# Altium project Amplifier.PrjPcb
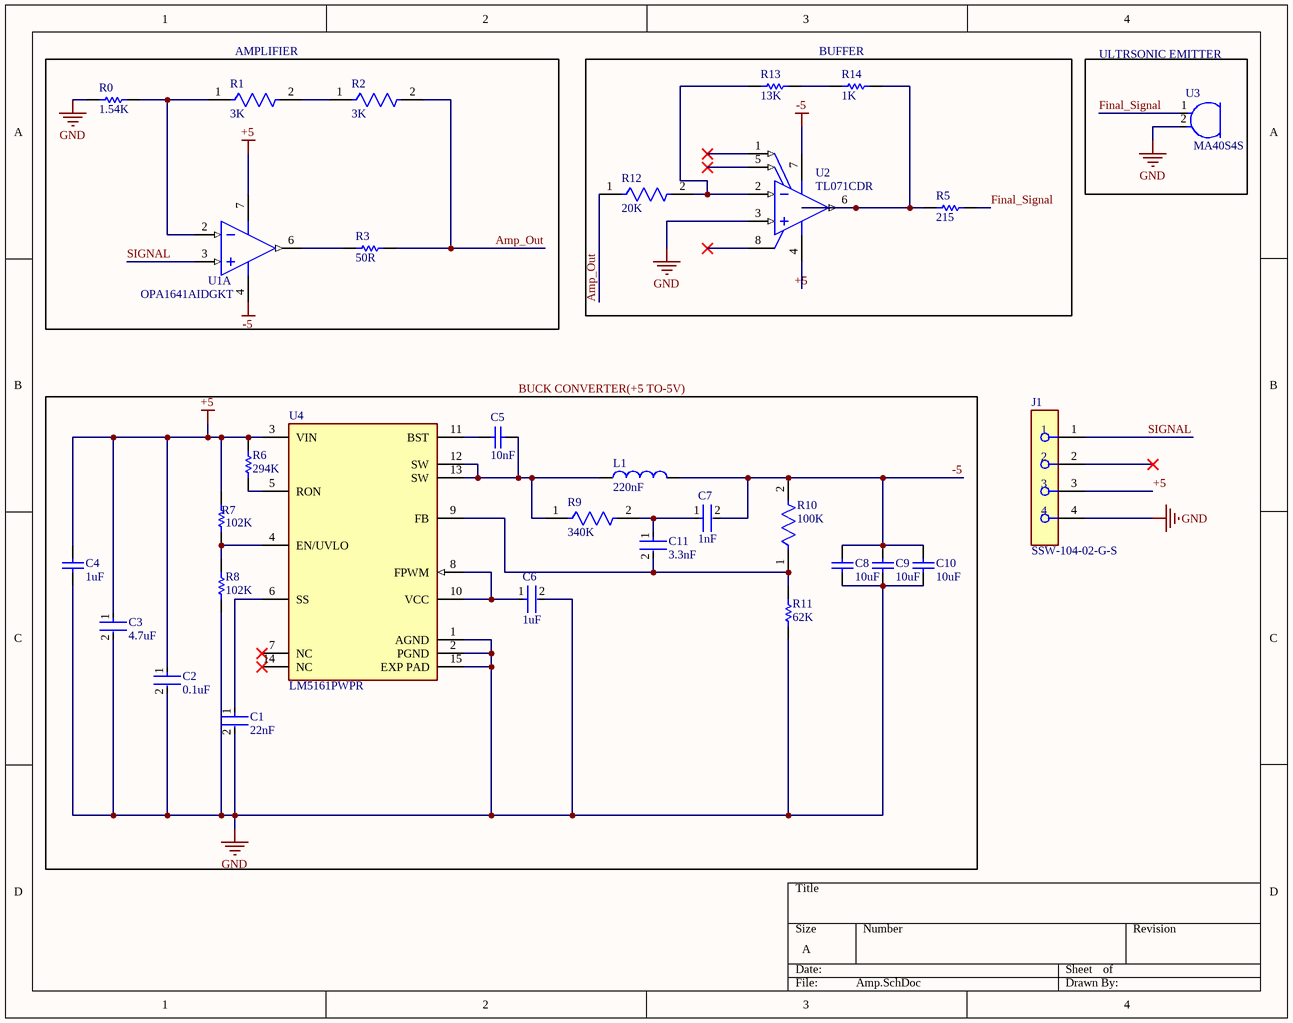
[diagram p0: Amp.SchDoc]
1 sheet, 31 parts. Net scope: global (net labels, ports and power ports of the same name join across sheets).
Board file: AmpPCB.PcbDoc

## Sheet Amp.SchDoc
size A; SheetNumber: 1; SheetTotal: 1

### Parts
C1  22nF  [FP-CGA4J-MFG]
C2  0.1uF  [FP-CC0805-0_85-MFG]
C3  4.7uF  [FP-GRM31C-0_2-e0_3_0_8-IPC_C]
C4  1uF  [CAPC3216X180X50ML20T25]
C5  10nF  [CAPC1005X55X25LL05T10]
C6  1uF  [FP-CGA3E-0_3-0_1-MFG]
C7  1nF  [FP-CGA2B-MFG]
C8  10uF  [CAPC3216X180X55LL20T25]
C9  10uF  [CAPC3216X180X55LL20T25]
C10  10uF  [CAPC3216X180X55LL20T25]
C11  3.3nF  [FP-CL31-IPC_C]
J1  SSW-104-02-G-S  [FP-SSW-104-02-G-S-MFG]
L1  220nF  [WE-HCF_2920]
R0  1.54K  [RESC2013X70X40LL20T20]
R1  3K  [FP-RC2012-MFG]
R2  3K  [FP-RC2012-MFG]
R3  50R  [RESC2013X70X40LL20T20]
R5  215  [RESC2013X70X40NL20T20]
R6  294K  [RESC1005X40X25LL05T05]
R7  102K  [RESC2013X60X35LL10T20]
R8  102K  [RESC2013X60X35LL10T20]
R9  340K  [FP-CRCW0402-e3-MFG]
R10  100K  [FP-RC0603-0_55-MFG]
R11  62K  [RESC1608X55X25NL10T15]
R12  20K  [FP-RT0805-MFG]
R13  13K  [RESC2013X70X40NL20T20]
R14  1K  [RESC2013X70X40ML20T20]
U1  OPA1641AIDGKT  [DGK0008A_N]  (part A of 2)
U2  TL071CDR  [D0008A_M]
U3  MA40S4S  [FP-MA40S4S-MFG]
U4  LM5161PWPR  [FP-PWP0014A-MFG]

### Blocks framed on the sheet
AMPLIFIER: R0-R3 U1
BUFFER: R5 R12-R14 U2
ULTRSONIC EMITTER: U3

### Nets
+5: C2.1 C3.1 C4.2 J1.3 R6.2 R7.2 U1.7(V+) U2.4(VCC-) U4.3(VIN)
-5: C7.2 C8.1 C9.1 C10.1 L1.2 R10.2 U1.4(V-) U2.7(VCC+)
GND: C1.2 C2.2 C3.2 C4.1 C6.2 C8.2 C9.2 C10.2 J1.4 R0.1 R8.1 R11.1 U2.3(IN+) U3.2 U4.1(AGND) U4.2(PGND) U4.15(EXP_PAD)
Amp_Out: R2.2 R3.2 R12.1
Final_Signal: R5.2 U3.1
SIGNAL: J1.1 U1.3(IN+)
NetC1_1: C1.1 U4.6(SS)
NetC5_1: C5.1 U4.11(BST)
NetC5_2: C5.2 L1.1 R9.1 U4.12(SW) U4.13(SW)
NetC6_1: C6.1 U4.8(FPWM) U4.10(VCC)
NetC7_1: C7.1 C11.1 R9.2
NetC11_2: C11.2 R10.1 R11.2 U4.9(FB)
NetR0_2: R0.2 R1.1 U1.2(IN-)
NetR1_2: R1.2 R2.1
NetR3_1: R3.1 U1.6(OUT)
NetR5_1: R5.1 R14.2 U2.6(OUT)
NetR6_1: R6.1 U4.5(RON)
NetR7_1: R7.1 R8.2 U4.4(EN/UVLO)
NetR12_2: R12.2 R13.1 U2.2(IN-)
NetR13_2: R13.2 R14.1

Not connected (* = marked no-connect by the designer): J1 2*; U2 1(OFFSET_N1)* 5(OFFSET_N2)* 8(NC)*; U4 7(NC)* 14(NC)*

### Notes on the sheet
- Labels drawn without touching a wire or pin: BUCK CONVERTER(+5 TO-5V)

### Library data of the parts
C1 = CMP-08246-000753-1: Cap Ceramic 22nF 50V C0G 5% Pad SMD 0805 +125°C Automotive T/R; Capacitance: 22nF; Case/Package: 0805; Lead Free: Lead Free; Ratings: AEC-Q200; Case Code (Imperial): 0805; Height: 1.25mm; Length: 2mm; Weight: 0.000194oz; Tolerance: 5%; Dielectric: C0G; Voltage Rating: 50V; Max Operating Temperature: 125°C; Mount: Surface Mount; Case Code (Metric): 2012; REACH SVHC: No SVHC; Depth: 1.25mm; Width: 0.049inch; Package Quantity: 1; Voltage Rating (DC): 50V; Termination: SMD/SMT; Min Operating Temperature: -55°C; Thickness: 0.057inch; Packaging: Tape and Reel; Composition: Ceramic
C2 = CMP-1036-04410-2: CAP CER 0.1UF 25V X7R 0805; Manufacturer Part Number: CC0805KRX7R8BB104; Manufacturer: Yageo; Tolerance: 0.1; Material: Ceramic; Value: 100 nF; ComponentLink2URL: http://www.yageo.com/documents/recent/UPY-GPHC_Y5V_6.3V-to-50V_8.pdf; Category: Cap; Mouser Description: Multilayer Ceramic Capacitors MLCC - SMD/SMT 100nF 25V X7R 10%; Device Class L1: Passive Components; Footprint Url: http://www.yageo.com/exep/pages/download/literatures/UPY-C_GEN_24.pdf; Height: 0.95mm; Digikey Description: CAP CER 0.1UF 25V X7R 0805; Lead Free: Yes; Temperature Range High: +85°C; Temperature: -30°C to +85°C; Ipc Land Pattern Name: CAPC200125X85; Capacitance: 100 nF; Automotive: No; Octopart: https://octopart.com/cc0805krx7r8bb104-yageo-39467766; Device Class L2: Capacitors; Temperature Characteristic: X7R; Voltage Rating: 25 V; ComponentLink2Description: Datasheet; Temperature Range Low: -30°C; Device Class L3: Ceramic Capacitors; RoHS: TRUE; Package: CC0805-0.85
C3 = CMP-1037-04923-3: Chip Multilayer Ceramic Capacitors for General Purpose, 1206, 4.7uF, X7R, 15%, 10%, 50V; Height: 1.6mm; Voltage: 50V; Capacitance: 4.7uF; Lead Free: Lead Free; Max Operating Temperature: 125°C; Packaging: Tape and Reel; REACH SVHC: No SVHC; Voltage Rating: 50V; Mount: Surface Mount; Termination: SMD/SMT; Tolerance: 10%; Case/Package: 1206; Material: Ceramic; Depth: 1.6mm; Length: 3.2mm; Case Code (Metric): 3216; Voltage Rating (DC): 50V; Case Code (Imperial): 1206; Radiation Hardening: No; Width: 0.063inch; Thickness: 0.071inch; Package Quantity: 2000; Min Operating Temperature: -55°C; Dielectric: X7R
C4 = CMP-2000-04991-1: Chip Capacitor, 1 uF, +/- 10%, 25 V, -55 to 125 degC, 1206 (3216 Metric), RoHS, Tape and Reel; Manufacturer: Kemet; Temperature Coefficient / Code: +/-15%; Dielectric: X7R; Voltage Rating DC: 25V; Capacitance - nF: 1000nF; Class: Class1; Case Length: 3.2mm; Type: SMDMLCCX7R6.3-250VDCCommericalGrade; Case Width: 1.6mm; Product: GeneralTypeMLCCs; Capacitance: 1uF; Datasheet URL: https://ciiva.com/datasheet-click-18194173?src=ciiva&sig=6daff8c4; Operating Temperature Range: -55Cto+125C; Series: C1206C; RoHS: Details; Product Category: MultilayerCeramicCapacitorsMLCC-SMD/SMT; Manufacturer URL: http://www.kemet.com/; Minimum Operating Temperature: -55C; Dimensions: 1.6mmWx3.2mmLx1.6mmH; Termination Style: SMD/SMT; Brand: Kemet; Packaging: Reel; Package / Case: 1206(3216metric); Case Code - mm: 3216; Datasheet Version: Jul-14; Factory Pack Quantity: 2000; Package Description: 2-Pin Surface Mount Device, Body 3.2 x 1.6 mm; Tolerance: 10%; Package Reference: 1206; Case Height: 1.6mm; Case Code - in: 1206; Maximum Operating Temperature: +125C; Voltage Rating: 25V
C5 = CMP-2000-06332-1: Chip Capacitor, 10 nF, 16 V, 10%, -55 to 125 degC, 0402 (1005 Metric), RoHS, Tape and Reel; Manufacturer: Murata; Rated Voltage: 16V; Capacitance: 10000pF; Dielectric: X7R; Manufacturer URL: http://www.murata.com/; Package Description: 2-Pin Surface Mount Device, Body 1 x 0.5 mm; Case Size/Dimension: 0402; Tolerance (%): ±10%; Datasheet Version: 06/2016; Package Reference: 0402; Mounting Technology: SurfaceMount; Datasheet URL: http://psearch.en.murata.com/capacitor/product/GRM155R71C103KA01%23.pdf
C6 = CMP-08246-002551-1: Cap Ceramic 1uF 35V X7R 10% Pad SMD 0603 +125°C Automotive T/R; Termination: SMD/SMT; Packaging: Tape and Reel; Capacitance: 1uF; Tolerance: 10%; Mount: Surface Mount; Thickness: 0.035inch; Case Code (Imperial): 0603; Voltage Rating: 35V; Case/Package: 0603; Case Code (Metric): 1608; Dielectric: X7R; Width: 0.031inch; Length: 0.063inch; Min Operating Temperature: -55°C; Weight: 7.1E-05oz; Max Operating Temperature: 125°C; Voltage Rating (DC): 35V; Height: 0.8mm; Ratings: AEC-Q200; Package Quantity: 4000
C7 = CMP-08246-002303-1: Cap Ceramic 1nF 50V X7R 10% Pad SMD 0402 +125°C Automotive T/R; Width: 0.02inch; Thickness: 0.022inch; Min Operating Temperature: -55°C; Mount: Surface Mount; Voltage Rating (DC): 50V; Voltage Rating: 50V; Termination: SMD/SMT; Capacitance: 1nF; Case/Package: 0402; Depth: 0.5mm; Length: 1mm; Ratings: AEC-Q200; Height: 0.5mm; Dielectric: X7R; Radiation Hardening: No; Lead Free: Lead Free; Composition: Ceramic; Max Operating Temperature: 125°C; Case Code (Imperial): 0402; Tolerance: 10%; Case Code (Metric): 1005; REACH SVHC: No SVHC; Package Quantity: 1; Packaging: Tape and Reel; Weight: 2.3E-05oz
C8-C10 = CMP-2000-06352-1: Chip Capacitor, 10 uF, +/- 10%, 16 V, -55 to 125 degC, 1206 (3216 Metric), RoHS, Tape and Reel; Manufacturer: Murata; Other Names: 490-3911-6; Product Training Modules: High-CapMultilayerCeramicCapacitors; Capacitance: 10µF; Temperature Coefficient: X7R; Catalog Drawings: GRMSeries_1206_1.6; Featured Product: GA3SafetyRecognizedCapsandHi-CapMLCC; Online Catalog: GRMSeries; Voltage - Rated: 16V; Size / Dimension: 0.126"Lx0.063"W(3.20mmx1.60mm); Applications: GeneralPurpose; Package Description: 2-Pin Surface Mount Device, Body 3.2 x 1.6 mm; Datasheet Version: 03/2016; Package Reference: 1206; Manufacturer URL: http://www.murata.com/; Standard Package: 1; Mounting Type: SurfaceMount,MLCC; Thickness (Max): 0.071"(1.80mm); Category: Capacitors; Family: CeramicCapacitors; Lead Spacing: -; Tolerance: ±10%; Packaging: Digi-Reel®; Lead Style: -; Package / Case: 1206(3216Metric); Datasheet URL: http://search.murata.co.jp/Ceramy/image/img/A01X/G101/ENG/GRM31CR71C106KAC7-01.pdf; Operating Temperature: -55°C~125°C; Mounting Technology: SurfaceMount; Series: GRM; Ratings: -; Height - Seated (Max): -; Features: -
C11 = CMP-13271-001980-1: Cap Ceramic 3.3nF 50V X7R ±10% SMD 1206 +125°C Embossed T/R; Width: 0.063inch; Package Quantity: 1; Mount: Surface Mount; Dielectric: X7R; Min Operating Temperature: -55°C; Tolerance: 10%; Voltage: 50V; Material: Ceramic; Case/Package: 1206; Depth: 1.6mm; Thickness: 0.039inch; Max Operating Temperature: 125°C; Case Code (Imperial): 1206; Height: 0.85mm; Length: 3.2mm; Packaging: Tape and Reel; Case Code (Metric): 3216; Radiation Hardening: No; Voltage Rating: 50V; Capacitance: 3.3nF
J1 = CMP-00575-00296407-1: SSW-104-02-G-S Board to Board & Mezzanine Connectors Tiger Buy Socket Strip with PCB Tails, .100 Pitch; NexarPartId: 296407; Manufacturer Lifecycle Status: PRODUCTION; Gender: Receptacle; Pitch: 2.54mm; Number of Positions: 4; Contact Resistance: 10mΩ; Connector Type: Receptacle, Socket; Voltage Rating: 550V; Max Current Rating: 6.9A; Voltage Rating (DC): 655V; Voltage Rating (AC): 465V; Current Rating: 4.7A; RoHS: Compliant; Lead Pitch: 2.54mm; Min Operating Temperature: -55°C; Housing Material: Polymer; Length: 10.67mm; Mount: Through Hole; Orientation: Straight; Lifecycle Status: Production; Lead Free: Lead Free; REACH SVHC: No SVHC; Number of Rows: 1; Contact Plating: Gold; Radiation Hardening: No; Max Operating Temperature: 125°C; Housing Color: Black; Height: 8.64mm; Contact Material: Bronze, Gold, Nickel; Width: 2.41mm; Number of Contacts: 4; Packaging: Bulk; Termination: Solder; Depth: 2.41mm; Max Voltage Rating (AC): 550V; Color: Black
L1 = CMP-03913-88969860-2: 74437529203221 WE-HCF High Current Inductor, 220uH, 8.8A, 2.8MHz, 36.45mOhm; Saturation Current: 4.1A; Inductance: 220µH; DC Resistance (DCR): 36.45mΩ; Inductance Tolerance: 20%; RoHS: Compliant; Width: 28mm; Min Operating Temperature: -40°C; Height: 20.5mm; Ambient Temperature Range Low: -40°C; Ambient Temperature Range High: 75°C; Length: 25mm; Max Operating Temperature: 125°C; NexarPartId: 88969860
R0 = CMP-2001-04443-1: Manufacturer: Panasonic; Part Number: ERJ-6ENF1541V
R1 R2 = CMP-13261-005524-1: Res Thick Film 0805 3kΩ 1% 0.125W ±100ppm/°C Molded SMD T/R; Max Power Dissipation: 125mW; Resistance: 3kR; Voltage Rating (DC): 150V; Radiation Hardening: No; Case/Package: 0805; Width: 0.049inch; Case Code (Imperial): 0805; Case Code (Metric): 2012; Military Standard: Not; Depth: 1.25mm; Length: 0.079inch; Temperature Coefficient: 100ppm/°C; Composition: Thick Film; Contact Plating: Tin; Features: Moisture Resistant; Max Operating Temperature: 155°C; Packaging: Tape and Reel; Number of Terminations: 2; Height: 0.024inch; Lead Free: Lead Free; Tolerance: 1%; Min Operating Temperature: -55°C
R3 = CMP-2001-00425-1: Part Number: ERJ-6GEYJ510V; Manufacturer: Panasonic
R5 = CMP-2001-00039-1: Manufacturer: Panasonic; Part Number: ERJ-6ENF2150V
R6 = CMP-2002-08443-1: Part Number: CRCW0402294KFKED; Manufacturer: Vishay Dale
R7 R8 = CMP-2001-04571-1: Part Number: RC0805FR-07105KL; Manufacturer: Yageo
R9 = CMP-2002-08533-2: RES Thick Film, 340kΩ, 1%, 0.063W, 100ppm/°C, 0402; Max Power Dissipation: 63mW; Voltage Rating: 50V; Resistance: 340kR; Height: 0.35mm; Military Standard: Not; Length: 1mm; Tolerance: 1%; Depth: 0.5mm; Min Operating Temperature: -55°C; Termination: SMD/SMT; Max Operating Temperature: 155°C; Features: Automotive AEC-Q200; Case Code (Metric): 1005; Power Rating: 63mW; Number of Pins: 2; Weight: 2.3E-05oz; Package Quantity: 10; Lead Free: Lead Free; Number of Terminations: 2; Temperature Coefficient: 100ppm/°C; Case/Package: 0402; Voltage Rating (DC): 50V; Case Code (Imperial): 0402; Contact Plating: Tin; Width: 0.5mm; Packaging: Tape and Reel; Composition: Thick Film; Radiation Hardening: No
R10 = CMP-2100-03662-2: RES SMD 100K OHM 1% 1/10W 0603; Voltage Rating (DC): 50V; Resistance: 100kR; Max Power Dissipation: 100mW; Temperature Coefficient: 100ppm/°C; Working Voltage: 75V; Length: 1.6mm; Lead Free: Lead Free; Number of Terminations: 2; Packaging: Tape and Reel; Voltage Rating: 50V; Termination: SMD/SMT; Width: 0.8mm; Resistor Type: Thick Film; Resistance Tolerance: 1%; Features: Moisture Resistant; Height: 0.45mm; Construction: Rectangular; Case/Package: 0603; Military Standard: Not; Case Code (Imperial): 0603; Series: RC; Technology: THICK FILM; Depth: 0.8mm; RoHS Compliant: Yes; REACH SVHC: No SVHC; Min Operating Temperature: -55°C; Case Code (Metric): 1608; Max Operating Temperature: 155°C; Power Rating: 100mW; Number of Pins: 2; Tolerance: 1%
R11 = CMP-2000-04104-1: Manufacturer: Yageo; Part Number: RC0603FR-0762KL
R12 = CMP-2001-01463-2: RES SMD 20K OHM 1% 1/8W 0805; Manufacturer: Yageo; Manufacturer Part Number: RT0805FRE0720KL; Power Rating: 0.125W; Value: 20KΩ; Voltage Rating: 150V; Tolerance: 0.0001; Temperature Coefficient: 50 ppm/°C; Height: 0.6mm; Lead Free: Yes; Device Class L3: Chip SMD Resistors; Series: RT; ComponentLink2URL: http://www.yageo.com/documents/recent/PYu-RT_1-to-0.01_RoHS_L_9.pdf; Footprint Url: http://www.yageo.com/exep/pages/download/literatures/PYu-R_Mount_10.pdf; Mouser Description: Thin Film Resistors - SMD 1/8W 20K ohm 1% 50ppm; Device Class L2: Resistors; Device Class L1: Passive Components; RoHS: TRUE; ComponentLink2Description: Datasheet; Category: Res; Package: RT0805; Digikey Description: RES SMD 20K OHM 1% 1/8W 0805; Temperature Range High: +155°C; Ipc Land Pattern Name: RESC200125X50; Temperature Range Low: -55°C; Octopart: https://octopart.com/rt0805fre0720kl-yageo-1410620; Resistance: 20KΩ; Temperature: -55°C to +155°C; Composition: Thin Film; Automotive: No
R13 = CMP-2001-04416-1: Part Number: ERJ-6ENF1302V; Manufacturer: Panasonic
R14 = CMP-2001-04375-5: Chip Resistor, 1 KOhm, +/- 1%, 0.125 W, -55 to 155 degC, 0805 (2012 Metric), RoHS, Tape and Reel; Manufacturer: Panasonic; Voltage Rating: 150 V; ComponentLink1URL: http://www.panasonic.com/; ComponentLink2Description: Datasheet; REACH SVHC: Yes; ComponentLink1Description: Manufacturer URL; Length: 2 mm; Height: 0.6 mm; Package Quantity: 1; PackageDescription: 2-Pin Surface Mount Device, Body 2 x 1.25 mm; Packaging: Cut Tape; PackageReference: 0805; Max Operating Temperature: 155 degC; Mounting Technology: Surface Mount; ComponentLink2URL: http://industrial.panasonic.com/cdbs/www-data/pdf/RDA0000/AOA0000C86.pdf; DatasheetVersion: 04/2015; Min Operating Temperature: -55 degC; RoHSCompliant: true; Mount: Surface Mount
U1 = CMP-0808-00041-2: Sound-Plus High-Performance, JFET-Input Audio Operational Amplifier, 4.5 to 36 V, -40 to 85 degC, 8-pin SOP (DGK8), Green (RoHS & no Sb/Br); Manufacturer: Texas Instruments; Number of Channels: 1; GBW(Typ)(MHz): 11; Iq per channel(Max)(mA): 2.3; Code_JEDEC: MO-187; ComponentLink1Description: Manufacturer URL; ComponentLink3Description: Package Specification; ComponentLink2URL: http://www.ti.com/general/docs/lit/getliterature.tsp?genericPartNumber=OPA1641&fileType=pdf; ComponentLink1URL: http://www.ti.com/; Eco-Plan: Green (RoHS & no Sb/Br); PartNumber: OPA1641AIDGKT; ComponentLink2Description: Datasheet; PackageDescription: 8-Pin Thin Small Outline, Body 3 x 3 mm, Pitch 0.65 mm; DatasheetVersion: SBOS484B; Mounting Technology: Surface Mount; SubFamily: Audio Operational Amplifier; ComponentLink3URL: http://www.ti.com/litv/pdf/mpds028d; PackageVersion: 4073329/E, 05/2006; PackageReference: DGK0008A
U2 = CMP-0017-00391-2: Low-Noise JFET-Input General-Purpose Operational Amplifier, 7 to 36 V, 0 to 70 degC, 8-pin SOIC (D8), Green (RoHS & no Sb/Br); Manufacturer: Texas Instruments; IIB(Max)(pA): 200; Total Supply Voltage(Min)(+5V is 5, +/-5V is 10): 7; GBW(Typ)(MHz): 3; Slew Rate(Typ)(V/us): 13; Rating: Military; Sub Family: General Purpose Amplifier, High Supply Voltage Amplifier (>=30V); Number of Channels: 1; Vn at 1kHz(Typ)(nV/rtHz): 18; Total Supply Voltage(Max)(+5V is 5, +/-5V is 10): 36; Iq per channel(Max)(mA): 2.5; CMRR(Min)(dB): 70; Vio (25C)(Max)(mV): 10; DatasheetVersion: SLOS080J; Eco-Plan: Green (RoHS & no Sb/Br); ComponentLink2URL: http://www.ti.com/lit/ds/symlink/tl071.pdf; Code_JEDEC: MS-012; PackageDescription: 8-Pin Plastic Small Outline, Body 4.9 x 3.9 mm, Pitch 1.27 mm; PartNumber: TL071CDR; ComponentLink1URL: http://www.ti.com/; ComponentLink2Description: Datasheet; ComponentLink1Description: Manufacturer URL; PackageReference: D0008A; Mounting Technology: Surface Mount; ComponentLink3URL: http://www.ti.com/litv/pdf/msoi002j; ComponentLink3Description: Package Specification; Offset Drift(Typ)(uV/C): 18; PackageVersion: 4040047-3/M, 06/2011
U3 = CMP-06153-000002-1: ULTRASONIC SENSOR TRANS 40KHZ; Voltage Rating: 20V; Capacitance: 2.55nF; Outside Diameter: 9.9mm; Max Operating Temperature: 85°C; Radiation Hardening: No; Frequency: 40kHz; Self Resonant Frequency: 40kHz; Mount: PCB; Voltage Rating (DC): 20V; Number of Pins: 2; Package Quantity: 100; Operating Supply Voltage: 20V; Lead Free: Lead Free; Termination: PCB; Length: 7.1mm; Min Operating Temperature: -40°C; Height: 7.1mm; REACH SVHC: No SVHC; Switching Frequency: 40kHz; Diameter: 10mm
U4 = CMP-04918-000082-1: IC REG BCK FLYBCK ADJ 14HTSSOP; Manufacturer: Texas Instruments; Switching Frequency: 1MHz; Output Current: 1A; Output Voltage: 2-92V; Switching Topology: Buck,Flyback; Max Junction Temp: +125°C; Standoff Height: 0.05mm; Min Supply Voltage: 4.5V; Output Type: AdjustableProgrammable; Nominal Supply Current: 2.3mA; Max Supply Voltage: 100V; Number Of Outputs: 1; Device Class L2: Power Management ICs; Package: PWP0014A; Temperature Range High: +125°C; Ipc Land Pattern Name: SOP65P640X110-14; RoHS: TRUE; Temperature: -40°C to +125°C; ComponentLink2URL: http://www.ti.com/lit/ds/symlink/lm5161.pdf; Automotive: No; Category: IC; Manufacturer Part Number: LM5161PWPR; ComponentLink2Description: Datasheet; Height: 1.1mm; Digikey Description: IC REG BCK FLYBCK ADJ 14HTSSOP; Temperature Range Low: -40°C; Octopart: https://octopart.com/lm5161pwpr-texas+instruments-71776617; Lead Free: Yes; Device Class L3: Voltage Regulators - Switching; Device Class L1: Integrated Circuits (ICs); Mouser Description: Wide Input 4.5-V to 100-V, 1-A Synchronous Buck / Fly-Buck Converter 14-HTSSOP -40 to 125